# Altium schematic sheet SPI_translators.SchDoc: FMC ADC 128CH 10B
size 420 x 297 mm; Author: G.Kasprowicz; CompanyName: WUT ISE; DrawnBy: G.Kasprowicz; Organization: WUT ISE; Address1: PW ISE; Address2: Nowowiejska 15/19 00-665 Warsaw; Address3: gkasprow@gmail.com; DocumentNumber: 8; Revision: 1; SheetNumber: 8; SheetTotal: 9; ModifiedBy: -; CheckedDate: -; Title2: SPi translators; DivGrp: WUT ISE; Designer: G.Kasprowicz; ModifiedDate: -; ProjectName: Sensor Box
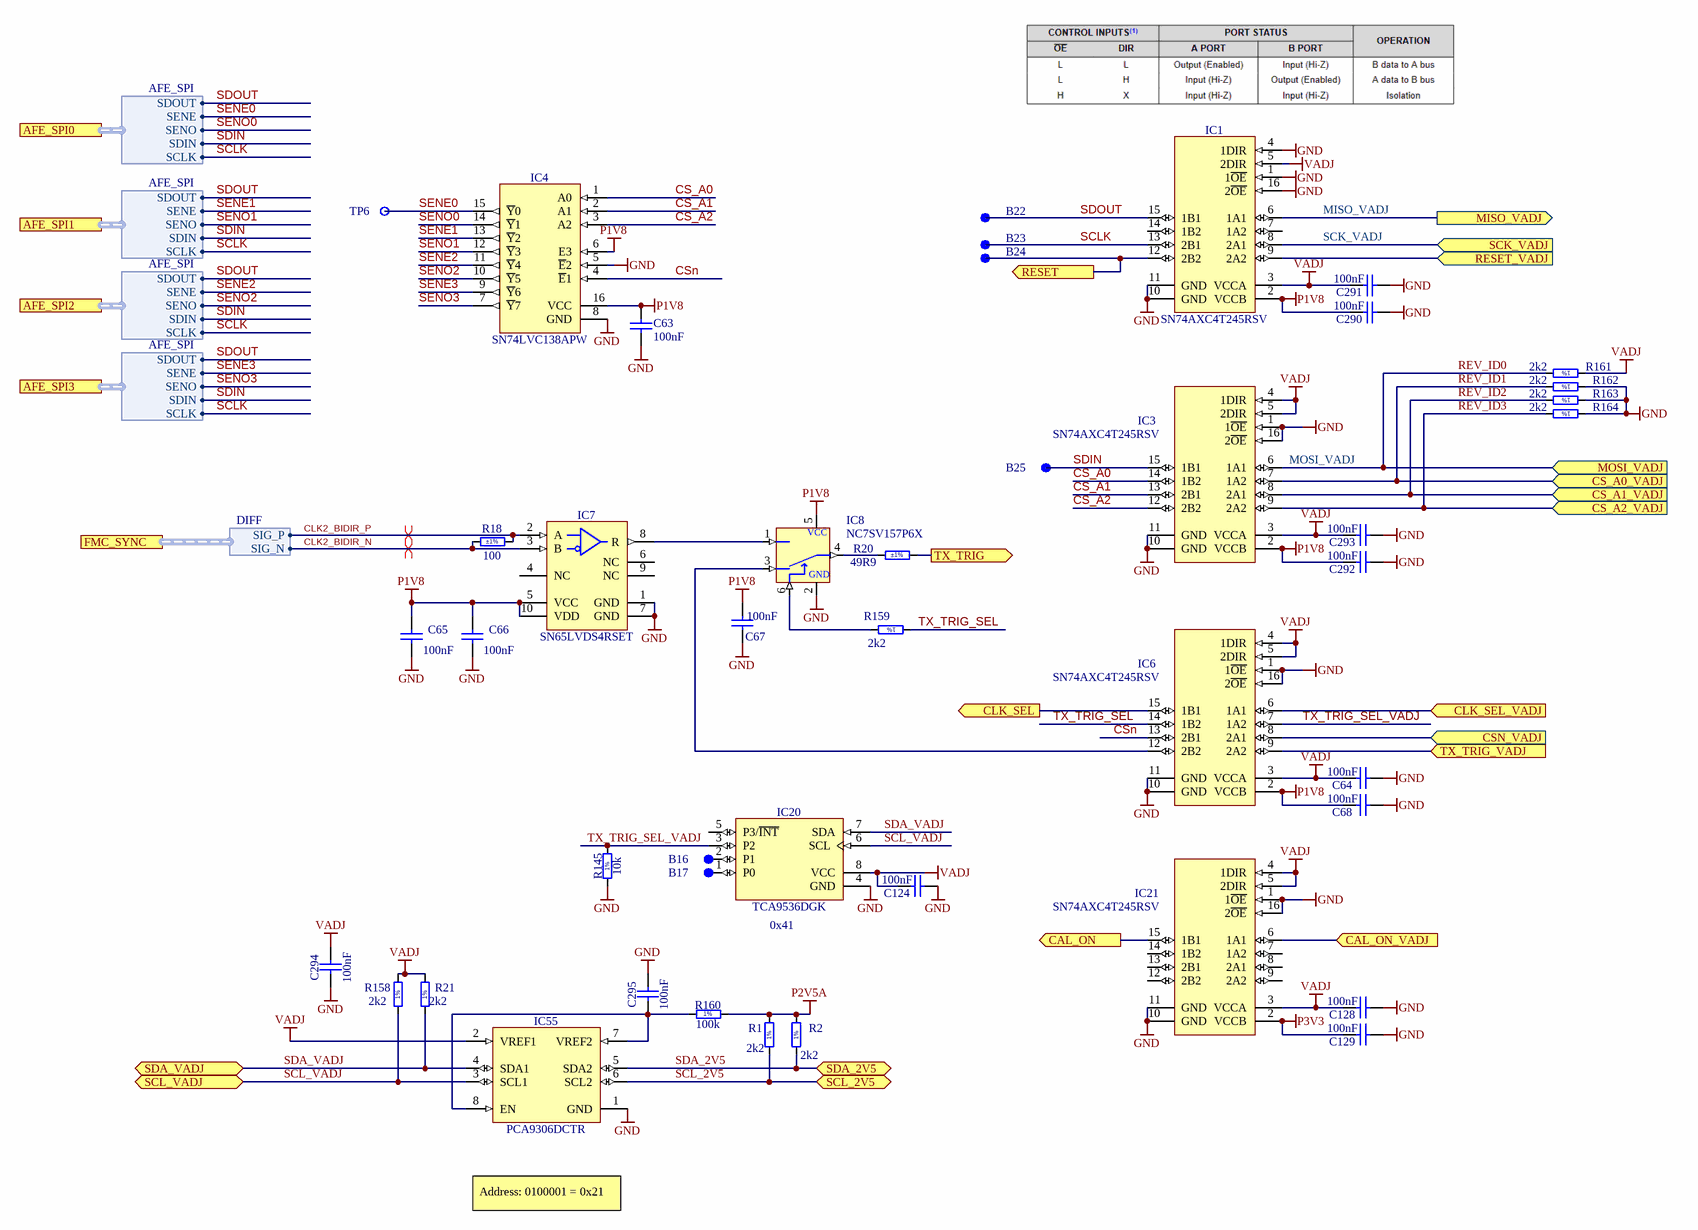
[diagram p0: SPI_translators.SchDoc]

## Parts
B16  SMD Pad  [C100]  (value not drawn)  (no BOM)
B17  SMD Pad  [C100]  (value not drawn)  (no BOM)
B22  SMD Pad  [C100]  (value not drawn)  (no BOM)
B23  SMD Pad  [C100]  (value not drawn)  (no BOM)
B24  SMD Pad  [C100]  (value not drawn)  (no BOM)
B25  SMD Pad  [C100]  (value not drawn)  (no BOM)
C63  100nF  [CAPC1005X55N]
C64  100nF  [CAPC0603X33N]
C65  100nF  [CAPC0603X33N]
C66  100nF  [CAPC0603X33N]
C67  100nF  [CAPC0603X33N]
C68  100nF  [CAPC0603X33N]
C124  100nF  [CAPC0603X33N]
C128  100nF  [CAPC0603X33N]
C129  100nF  [CAPC0603X33N]
C290  100nF  [CAPC0603X33N]
C291  100nF  [CAPC0603X33N]
C292  100nF  [CAPC0603X33N]
C293  100nF  [CAPC0603X33N]
C294  100nF  [CAPC0603X33N]
C295  100nF  [CAPC0603X33N]
IC1  SN74AXC4T245RSV  [QFN40P180X260X55-16N]
IC3  SN74AXC4T245RSV  [QFN40P180X260X55-16N]
IC4  SN74LVC138APW  [SOP65P640X110-16N]
IC6  SN74AXC4T245RSV  [QFN40P180X260X55-16N]
IC7  SN65LVDS4RSET  [TEXAS_RSE (R-PUQFN-N10)]
IC8  NC7SV157P6X  [SC70-6]
IC20  TCA9536DGK  [SOP65P490X110-8N]
IC21  SN74AXC4T245RSV  [QFN40P180X260X55-16N]
IC55  PCA9306DCTR  [SOP65P400X130-8N]
R1  2k2  [RESC1005X40N]
R2  2k2  [RESC1005X40N]
R18  100  Tolerance: ±1%  [RESC1005X40N]
R20  49R9  Tolerance: ±1%  [RESC1005X40N]
R21  2k2  [RESC1005X40N]
R145  10k  [RESC1005X40N]
R158  2k2  [RESC1005X40N]
R159  2k2  [RESC1005X40N]
R160  100k  [RESC1005X40N]
R161  2k2  [RESC1005X40N]
R162  2k2  [RESC1005X40N]
R163  2k2  [RESC1005X40N]
R164  2k2  [RESC1005X40N]
TP6  Test Point  [TPS127]  (value not drawn)  (no BOM)

## Ports
AFE_SPI0 (harness AFE_SPI), AFE_SPI1 (harness AFE_SPI), AFE_SPI2 (harness AFE_SPI), AFE_SPI3 (harness AFE_SPI), CAL_ON (out), CAL_ON_VADJ (in), CLK_SEL (out), CLK_SEL_VADJ (in), CS_A0_VADJ (in), CS_A1_VADJ (in), CS_A2_VADJ (in), CSN_VADJ (in), FMC_SYNC (harness DIFF), MISO_VADJ (out), MOSI_VADJ (in), RESET (out), RESET_VADJ (in), SCK_VADJ (in), SCL_2V5 (bidir), SCL_VADJ (bidir), SDA_2V5 (bidir), SDA_VADJ (bidir), TX_TRIG (out), TX_TRIG_VADJ (in)

## Harnesses
AFE_SPI: SDOUT, SENE, SENO, SDIN, SCLK
DIFF: SIG_P, SIG_N

## Nets
GND: C63.1 C64.2 C65.2 C66.2 C67.1 C68.2 C124.2 C128.2 C129.2 C290.2 C291.2 C292.2 C293.2 C294.1 C295.2 IC1.1(1~{OE}) IC1.4(1DIR) IC1.10(GND) IC1.11(GND) IC1.16(2~{OE}) IC3.1(1~{OE}) IC3.10(GND) IC3.11(GND) IC3.16(2~{OE}) IC4.5(~{E}2) IC4.8(GND) IC6.1(1~{OE}) IC6.10(GND) IC6.11(GND) IC6.16(2~{OE}) IC7.1(GND) IC7.7(GND) IC8.2(GND) IC20.4(GND) IC21.1(1~{OE}) IC21.10(GND) IC21.11(GND) IC21.16(2~{OE}) IC55.1(GND) R145.1 R162.1 R163.1 R164.1
P1V8: C63.2 C65.1 C66.1 C67.2 C68.1 C290.1 C292.1 IC1.2(VCCB) IC3.2(VCCB) IC4.6(E3) IC4.16(VCC) IC6.2(VCCB) IC7.5(VCC) IC7.10(VDD) IC8.5(Vcc)
P2V5A: R1.2 R2.2 R160.2
P3V3: C129.1 IC21.2(VCCB)
VADJ: C64.1 C124.1 C128.1 C291.1 C293.1 C294.2 IC1.3(VCCA) IC1.5(2DIR) IC3.3(VCCA) IC3.4(1DIR) IC3.5(2DIR) IC6.3(VCCA) IC6.4(1DIR) IC6.5(2DIR) IC20.8(VCC) IC21.3(VCCA) IC21.4(1DIR) IC21.5(2DIR) IC55.2(VREF1) R21.2 R158.2 R161.1
CAL_ON: IC21.15(1B1) ; port CAL_ON
CAL_ON_VADJ: IC21.6(1A1) ; port CAL_ON_VADJ
CLK2_BIDIR_N: IC7.3(B) R18.1 ; port FMC_SYNC.SIG_N
CLK2_BIDIR_P: IC7.2(A) R18.2 ; port FMC_SYNC.SIG_P
CLK_SEL: IC6.15(1B1) ; port CLK_SEL
CLK_SEL_VADJ: IC6.6(1A1) ; port CLK_SEL_VADJ
CS_A0: IC3.14(1B2) IC4.1(A0)
CS_A1: IC3.13(2B1) IC4.2(A1)
CS_A2: IC3.12(2B2) IC4.3(A2)
CSn: IC4.4(~{E}1) IC6.13(2B1)
CSN_VADJ: IC6.8(2A1) ; port CSN_VADJ
MISO_VADJ: IC1.6(1A1) ; port MISO_VADJ
MOSI_VADJ: IC3.6(1A1) R161.2 ; port MOSI_VADJ  [also labelled REV_ID0]
RESET: B24.1 IC1.12(2B2) ; port RESET
RESET_VADJ: IC1.9(2A2) ; port RESET_VADJ
REV_ID1: IC3.7(1A2) R162.2 ; port CS_A0_VADJ
REV_ID2: IC3.8(2A1) R163.2 ; port CS_A1_VADJ
REV_ID3: IC3.9(2A2) R164.2 ; port CS_A2_VADJ
SCK_VADJ: IC1.8(2A1) ; port SCK_VADJ
SCL_2V5: IC55.6(SCL2) R1.1 ; port SCL_2V5
SCL_VADJ: IC20.6(SCL) IC55.3(SCL1) R158.1 ; port SCL_VADJ
SCLK: B23.1 IC1.13(2B1) ; port AFE_SPI0.SCLK, port AFE_SPI1.SCLK, port AFE_SPI2.SCLK, port AFE_SPI3.SCLK
SDA_2V5: IC55.5(SDA2) R2.1 ; port SDA_2V5
SDA_VADJ: IC20.7(SDA) IC55.4(SDA1) R21.1 ; port SDA_VADJ
SDIN: B25.1 IC3.15(1B1) ; port AFE_SPI0.SDIN, port AFE_SPI1.SDIN, port AFE_SPI2.SDIN, port AFE_SPI3.SDIN
SDOUT: B22.1 IC1.15(1B1) ; port AFE_SPI0.SDOUT, port AFE_SPI1.SDOUT, port AFE_SPI2.SDOUT, port AFE_SPI3.SDOUT
SENE0: IC4.15(~{Y}0) TP6.1 ; port AFE_SPI0.SENE
SENE1: IC4.13(~{Y}2) ; port AFE_SPI1.SENE
SENE2: IC4.11(~{Y}4) ; port AFE_SPI2.SENE
SENE3: IC4.9(~{Y}6) ; port AFE_SPI3.SENE
SENO0: IC4.14(~{Y}1) ; port AFE_SPI0.SENO
SENO1: IC4.12(~{Y}3) ; port AFE_SPI1.SENO
SENO2: IC4.10(~{Y}5) ; port AFE_SPI2.SENO
SENO3: IC4.7(~{Y}7) ; port AFE_SPI3.SENO
TX_TRIG: R20.2 ; port TX_TRIG
TX_TRIG_SEL: IC6.14(1B2) R159.1
TX_TRIG_SEL_VADJ: IC6.7(1A2) IC20.3(P2) R145.2
TX_TRIG_VADJ: IC6.9(2A2) ; port TX_TRIG_VADJ
NetB16_1: B16.1 IC20.2(P1)
NetB17_1: B17.1 IC20.1(P0)
NetC295_1: C295.1 IC55.7(VREF2) IC55.8(EN) R160.1
NetIC6_12: IC6.12(2B2) IC8.3(I0)
NetIC7_8: IC7.8(R) IC8.1(I1)
NetIC8_4: IC8.4(Z) R20.1
NetIC8_6: IC8.6(S) R159.2

Not connected (* = marked no-connect by the designer): IC1 7(1A2) 14(1B2); IC7 4(NC) 6(NC) 9(NC); IC20 5(P3/~{INT}); IC21 7(1A2) 8(2A1) 9(2A2) 12(2B2) 13(2B1) 14(1B2)

## Layout directives
differential pair: CLK2_BIDIR_N, CLK2_BIDIR_P

## Notes on the sheet
- (near IC20) 0x41
- Address: 0100001 = 0x21
- Project/Equipment
- Document
- Designer
- Drawn by
- Check.by
- Copyright WUT ISE 2018.
  This documentation describes Open Hardware and is licensed under the CERN OHL v.1.1. You may redistribute and modify this documentation under the terms of the CERN OHL v.1.1. (http://ohwr.org/CERNOHL). This documentation is distributed WITHOUT ANY EXPRESS OR IMPLIED WARRANTY, INCLUDING OF MERCHANTABILITY, SATISFACTORY QUALITY AND FITNESS FOR A PARTICULAR PURPOSE. Please see the CERN OHL v.1.1 for applicable conditions.
- Contact
- File
- Last Mod.
- Print Date
- Sheet
- Size
- A3
- of
- Rev
- (in symbol 74_NC7SV157P6X) VCC
- (in symbol R0402_2K2_1%_0.0625W_100PPM) 1%
- (in symbol R0402_10K_1%_0.0625W_100PPM) 1%
- (in symbol R0402_100K_1%_0.0625W_100PPM) 1%

## Library data of the parts
B16 B17 B22-B25 = SMD_PAD_D1MM: Through Hole Pad; Part Description: 1mm Diameter SMD Pad; Mounted: No; Part Number: SMD_PAD_D1MM; Component Type: Standard (No BOM); Pin Count: 1; Family: SMD Pad; Socket: No; SMD: No; Sense: No; Status: None; ComponentHeight: 0mm; HelpURL: Undefined; Author: CERN DEM JLC; CreateDate: 10.10.2017; LatestRevisionDate: 10.10.2017; PackageDescription: 1mm Diameter SMD Pad
C63 = CC0402_100NF_16V_10%_X5R: Non-polarised capacitor; Part Description: SMD Multilayer Chip Ceramic Capacitor; Manufacturer: GENERIC; Manufacturer1 Part Number: GRM155R61C104KA88D; Voltage: 16V; TC: X5R; Tolerance: ±10%; Part Number: CC0402_100NF_16V_10%_X5R; Component Kind: Standard; Component Type: Standard; Pin Count: 2; Value: 100nF; Status: None; Manufacturer Part Number: CC0402_100NF_16V_10%_X5R; Case: 0402; Mounted: Yes; Socket: No; SMD: Yes; Sense: No; Manufacturer1 Example: MURATA; Manufacturer1 ComponentHeight: 0.55mm; HelpURL: \\cern.ch\dfs\Applications\Altium\Datasheets\CC0402_X5R_MURATA_GRM.pdf; Author: CERN DEM JLC; CreateDate: 10.12.2013; LatestRevisionDate: 10.12.2013
C64-C68 C124 C128 C129 C290-C295 = CC0201_100NF_6.3V_10%_X5R: Non-polarised capacitor; Manufacturer: GENERIC; Part Description: SMD Multilayer Chip Ceramic Capacitor; Manufacturer1 Part Number: 02016D104KAT2A; Tolerance: ±10%; Voltage: 6.3V; TC: X5R; Manufacturer Part Number: CC0201_100NF_6.3V_10%_X5R; Part Number: CC0201_100NF_6.3V_10%_X5R; Value: 100nF; Component Kind: Standard; Component Type: Standard; Pin Count: 2; Status: Not Recommended; Case: 0201; Mounted: Yes; Socket: No; SMD: Yes; Sense: No; Manufacturer1 Example: AVX; Manufacturer1 ComponentHeight: 0.33mm; HelpURL: \\cern.ch\dfs\Applications\Altium\Datasheets\CC0201_X5R_AVX.pdf; Author: CERN DEM JLC; CreateDate: 03.12.2007; LatestRevisionDate: 03.12.2007
IC1 IC3 IC6 IC21 = SN74AXC4T245: 4-Bit Dual-Supply Bus Transceiver with Configurable Voltage Translation and 3-State Output; Part Description: 4-Bit Dual-Supply Bus Transceiver With Configurable Voltage Translation and 3-State Outputs; Manufacturer: TEXAS INSTRUMENTS; PressFit: No; Bonding: No; Part Number: SN74AXC4T245RSV; Component Kind: Standard; Component Type: Standard; Device: SN74AXC4T245RSV; PackageDescription: QFN, 0.40mm Pitch, Rect.; 16 Pin, 2.60mm L X 1.80mm W X 0.55mm H Body, IPC Medium Density; Status: Recommended; Manufacturer Part Number: SN74AXC4T245RSV; Pin Count: 16; Case: QFN16; Mounted: Yes; Socket: No; SMD: Yes; Sense: No; ComponentHeight: 0.55mm; Author: GK; HelpURL: \\cern.ch\dfs\Applications\Altium\Datasheets\SN74AVC4T245RSVR.pdf; CreateDate: 08.07.2014; LatestRevisionDate: 30.03.2017
IC4 = SN74LVC138APW: 3-Line to 8-Line Decoder/Demultiplexer; Part Description: 3-Line to 8-Line Decoder/Demultiplexer, Inverting; Manufacturer: Texas Instruments; PressFit: No; Bonding: No; Part Number: SN74LVC138APW; Component Kind: Standard; Component Type: Standard; Device: SN74LVC138APW; PackageDescription: SOP, 0.65mm pitch; 16 pin, 4.40mm W X 5.00mm L X 1.10mm H body IPC Medium Density; Manufacturer Part Number: SN74LVC138APW; Pin Count: 16; Case: TSSOP16; Mounted: Yes; Socket: No; SMD: Yes; Sense: No; ComponentHeight: 1.1mm; Author: GK; HelpURL: \\cern.ch\dfs\Applications\Altium\Datasheets\74HC138PW.pdf; CreateDate: 09/06/2015; LatestRevisionDate: 09/06/2015
IC7 = SN65LVDS4RSET: 1.8V High-Speed Differential Line Receiver; Manufacturer: TEXAS INSTRUMENTS; PressFit: No; Bonding: No; Part Number: SN65LVDS4RSET; Component Kind: Standard; Component Type: Standard; Device: SN65LVDS4RSET; PackageDescription: QFN, TEXAS Case Style RSE (R-PUQFN-N10), 0.50mm Pitch; 10 Pin, 1.50mm W  X 2.00mm L X 0.60mm H body; Part Description: 1.8V High-Speed Differential Line Receiver; Manufacturer Part Number: SN65LVDS4RSET; Pin Count: 10; Case: QFN10; Mounted: Yes; Socket: No; SMD: Yes; Sense: No; ComponentHeight: 0.6mm; Author: CERN DEM JMW; HelpURL: \\cern.ch\dfs\Applications\Altium\Datasheets\SN65LVDS4RSET.pdf; CreateDate: 14.09.2015; LatestRevisionDate: 14.09.2015
IC8 = 74_NC7SV157P6X: TinyLogic ULP-A 2-Input Non-Inverting Multiplexer
IC20 = TCA9536DGK: Remote 4-Bit I2C and SMBus I/O Expander with Configuration Registers; Manufacturer: TEXAS INSTRUMENTS; PressFit: No; Bonding: No; Part Number: TCA9536DGK; Component Kind: Standard; Component Type: Standard; Device: TCA9536DGK; PackageDescription: SOP, 0.65mm Pitch; 8 Pin, 3.00mm W X 3.00mm L X 1.10mm H body, IPC Medium Density; Part Description: Remote 4-Bit I2C and SMBus I/O Expander with Configuration Registers; Manufacturer Part Number: TCA9536DGK; Pin Count: 8; Case: TSSOP8; Mounted: Yes; Socket: No; SMD: Yes; Sense: No; ComponentHeight: 1.1mm; Author: CERN DEM HF; HelpURL: \\cern.ch\dfs\Applications\Altium\Datasheets\TCA9536A.pdf; CreateDate: 20.01.2025; LatestRevisionDate: 20.01.2025
IC55 = PCA9306DCTR: Dual Bidirectional I2C Bus And SMBus Voltage-Level Translator; Manufacturer: TEXAS INSTRUMENTS; Table: Analog & Interface; Part Number: PCA9306DCTR; Component Kind: Standard; Component Type: Standard; Device: PCA9306DCTR; PackageDescription: SOP, 0.65mm, Pitch; 8 Pin, 2.80mm W X 2.95mm L X 1.30mm H Body, PC Medium Density; Part Description: Dual Bidirectional I2C Bus And SMBus Voltage-Level Translator; Manufacturer Part Number: PCA9306DCTR; Pin Count: 8; Case: SSOP8; Mounted: Yes; Socket: No; SMD: Yes; ComponentHeight: 1.3mm; Author: CERN DEM JLC; HelpURL: \\cern.ch\dfs\Applications\Altium\Datasheets\PCA9306DCTR.pdf; CreateDate: 2013-02-25; LatestRevisionDate: 2013-02-25
R1 R2 R21 R158 R159 R161-R164 = R0402_2K2_1%_0.0625W_100PPM: Resistor - 1%; Part Description: General Purpose Thick Film Chip Resistor; Manufacturer: GENERIC; Manufacturer1 Part Number: 232270672202L; TC: ±100ppm/°C; Table: Resistors SMD; Part Number: R0402_2K2_1%_0.0625W_100PPM; Component Kind: Standard; Component Type: Standard; Pin Count: 2; Value: 2k2; Status: Not recommended; Power: 0.0625W; Tolerance: ±1%; Manufacturer Part Number: R0402_2K2_1%_0.0625W_100PPM; Case: 0402; Mounted: Yes; Socket: No; SMD: Yes; Manufacturer1 Example: YAGEO PHYCOMP; Manufacturer1 ComponentHeight: 0.4mm; HelpURL: \\cern.ch\dfs\Applications\Altium\Datasheets\R0402_Phycomp_RC0402.pdf; Author: CERN DEM JLC; CreateDate: 2007-12-03; LatestRevisionDate: 2012-10-17
R18 = R0402_100R_1%_0.0625W_100PPM: Resistor - 1%; Part Description: General Purpose Thick Film Chip Resistor; Manufacturer: GENERIC; Manufacturer1 Part Number: 232270671001L; TC: ±100ppm/°C; PressFit: No; Part Number: R0402_100R_1%_0.0625W_100PPM; Component Kind: Standard; Component Type: Standard; Pin Count: 2; Value: 100; Status: Not Recommended; Power: 0.0625W; Manufacturer Part Number: R0402_100R_1%_0.0625W_100PPM; Case: 0402; Mounted: Yes; Sense: No; Socket: No; SMD: Yes; Manufacturer1 Example: YAGEO PHYCOMP; Manufacturer1 ComponentHeight: 0.4mm; HelpURL: \\cern.ch\dfs\Applications\Altium\Datasheets\R0402_Phycomp_RC0402.pdf; Author: CERN DEM JLC; CreateDate: 03.12.2007; LatestRevisionDate: 17.10.2012
R20 = R0402_49R9_1%_0.0625W_100PPM: Resistor - 1%; Part Description: General Purpose Thick Film Chip Resistor; Manufacturer: GENERIC; Manufacturer1 Part Number: 232270674999L or RC0402FR-0749R9L; TC: ±100ppm/°C; PressFit: No; Part Number: R0402_49R9_1%_0.0625W_100PPM; Component Kind: Standard; Component Type: Standard; Pin Count: 2; Value: 49R9; Status: Not Recommended; Power: 0.0625W; Manufacturer Part Number: R0402_49R9_1%_0.0625W_100PPM; Case: 0402; Mounted: Yes; Sense: No; Socket: No; SMD: Yes; Manufacturer1 Example: YAGEO PHYCOMP; Manufacturer1 ComponentHeight: 0.4mm; HelpURL: \\cern.ch\dfs\Applications\Altium\Datasheets\R0402_Phycomp_RC0402.pdf; Author: CERN DEM JLC; CreateDate: 24.10.2012; LatestRevisionDate: 24.10.2012
R145 = R0402_10K_1%_0.0625W_100PPM: Resistor - 1%; Part Description: General Purpose Thick Film Chip Resistor; Manufacturer: GENERIC; Manufacturer1 Part Number: 232270671003L; TC: ±100ppm/°C; Table: Resistors SMD; Part Number: R0402_10K_1%_0.0625W_100PPM; Component Kind: Standard; Component Type: Standard; Pin Count: 2; Value: 10k; Status: Not recommended; Power: 0.0625W; Tolerance: ±1%; Manufacturer Part Number: R0402_10K_1%_0.0625W_100PPM; Case: 0402; Mounted: Yes; Socket: No; SMD: Yes; Manufacturer1 Example: YAGEO PHYCOMP; Manufacturer1 ComponentHeight: 0.4mm; HelpURL: \\cern.ch\dfs\Applications\Altium\Datasheets\R0402_Phycomp_RC0402.pdf; Author: CERN DEM JLC; CreateDate: 3/12/2007; LatestRevisionDate: 17/10/2012
R160 = R0402_100K_1%_0.0625W_100PPM: Resistor - 1%; Part Description: General Purpose Thick Film Chip Resistor; Manufacturer: GENERIC; Manufacturer1 Part Number: 232270671004L; TC: ±100ppm/°C; Table: Resistors SMD; Part Number: R0402_100K_1%_0.0625W_100PPM; Component Kind: Standard; Component Type: Standard; Pin Count: 2; Value: 100k; Status: Not recommended; Power: 0.0625W; Tolerance: ±1%; Manufacturer Part Number: R0402_100K_1%_0.0625W_100PPM; Case: 0402; Mounted: Yes; Socket: No; SMD: Yes; Manufacturer1 Example: YAGEO PHYCOMP; Manufacturer1 ComponentHeight: 0.4mm; HelpURL: \\cern.ch\dfs\Applications\Altium\Datasheets\R0402_Phycomp_RC0402.pdf; Author: CERN DEM JLC; CreateDate: 2007-12-03; LatestRevisionDate: 2012-10-17
TP6 = SMD_PAD_1.27X1.27MM: Part Description: 1.27mm x 1.27mm PCB Copper Area (SMD Test Point); Mounted: No; Part Number: SMD_PAD_1.27X1.27MM; Component Type: Standard (No BOM); Pin Count: 1; Family: Test Point; Socket: No; SMD: Yes; Sense: No; Status: None; ComponentHeight: 0mm; HelpURL: Undefined; Author: CERN DEM JLC; CreateDate: 12.01.2008; LatestRevisionDate: 12.01.2008; PackageDescription: 1.27mm x 1.27mm PCB Copper Area (SMD Test Point)